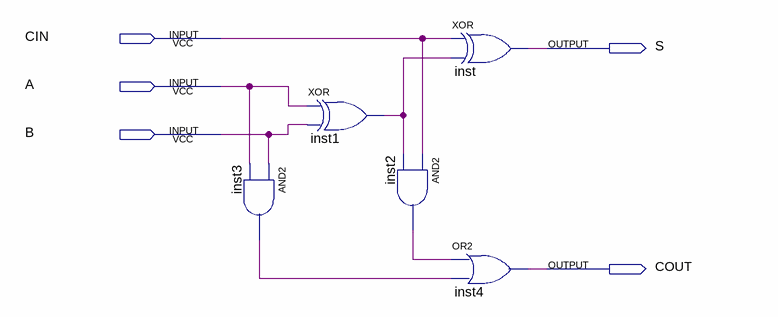
[diagram p0: schematic sheet]
// Quartus schematic Full_Adder_1bit.bdf as structural Verilog: 5 symbols, 5 pins
module Full_Adder_1bit (
  input  CIN,
  input  A,
  input  B,
  output S,
  output COUT
);

  wire inst1_out, inst2_out, inst3_out;

  and inst3 (inst3_out, B, A);
  xor inst1 (inst1_out, A, B);
  and inst2 (inst2_out, CIN, inst1_out);
  xor inst (S, CIN, inst1_out);
  or inst4 (COUT, inst2_out, inst3_out);
endmodule
